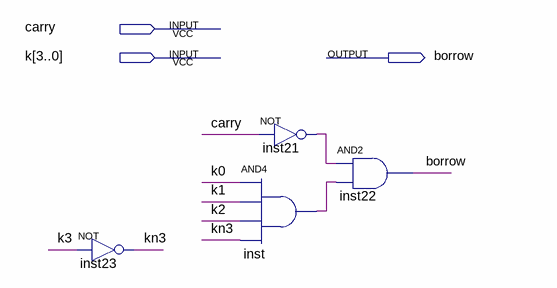
[diagram p0: schematic sheet]
// Quartus schematic borrow_check_ahmes.bdf as structural Verilog: 4 symbols, 3 pins
module borrow_check_ahmes (
  input  carry,
  input  [3:0] k,
  output borrow
);

  wire inst21_out, inst_out, kn3;

  not inst23 (kn3, k[3]);
  not inst21 (inst21_out, carry);
  and inst (inst_out, k[0], k[1], k[2], kn3);
  and inst22 (borrow, inst21_out, inst_out);
endmodule
